# Altium project FMC_DAC_125M_14B_16CHA.PrjPCB (part 4 of 4)
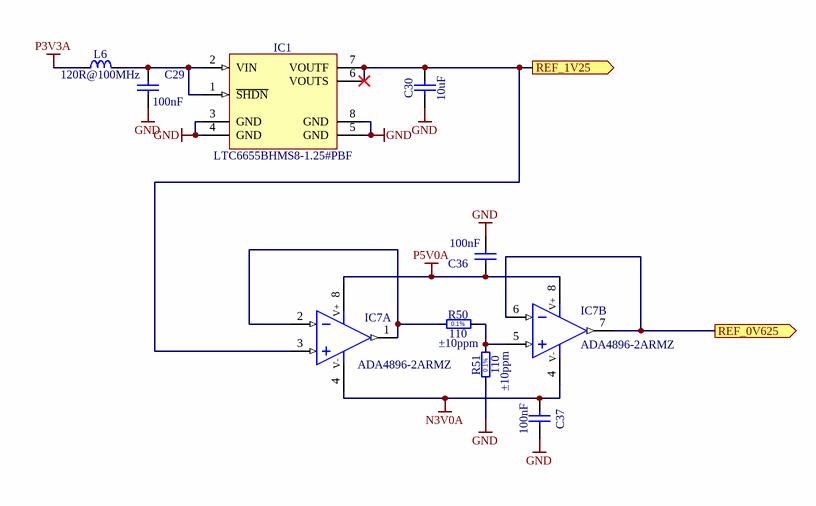
[diagram p10: References.SchDoc]

## Nets that join several sheets
3P3VAUX: EEPROM_Temp (12 pins), FMC connector (J1.d32)
GND: FMC_DAC_125M_14B_16CHA (7 pins), EEPROM_Temp (14 pins), FMC connector (164 pins), power_supply (16 pins), U_SAS_Connectors0 (18 pins), U_DAC_AFE0 (9 pins), U_DAC_AFE1 (9 pins), U_DAC_AFE2 (9 pins), U_DAC_AFE3 (9 pins), U_DAC_AFE4 (9 pins), U_DAC_AFE5 (9 pins), U_DAC_AFE6 (9 pins), U_DAC_AFE7 (9 pins), U_DAC_AFE8 (9 pins), U_DAC_AFE9 (9 pins), U_DAC_AFE10 (9 pins), U_DAC_AFE11 (9 pins), U_DAC_AFE12 (9 pins), U_DAC_AFE13 (9 pins), U_DAC_AFE14 (9 pins), U_DAC_AFE15 (9 pins), U_SAS_Connectors1 (18 pins), U_DACs0 (12 pins), U_DACs1 (12 pins), U_DACs2 (12 pins), U_DACs3 (12 pins), U_DACs4 (12 pins), U_DACs5 (12 pins), U_DACs6 (12 pins), U_DACs7 (12 pins), Clock_circuit (27 pins), AFE_buffers0 (8 pins), AFE_buffers1 (8 pins), References (9 pins)
N3V0A: power_supply (J8.7 J8.8), U_DAC_AFE0 (L2A.1), U_DAC_AFE1 (L2B.1), U_DAC_AFE2 (L2C.1), U_DAC_AFE3 (L2D.1), U_DAC_AFE4 (L2E.1), U_DAC_AFE5 (L2F.1), U_DAC_AFE6 (L2G.1), U_DAC_AFE7 (L2H.1), U_DAC_AFE8 (L2I.1), U_DAC_AFE9 (L2J.1), U_DAC_AFE10 (L2K.1), U_DAC_AFE11 (L2L.1), U_DAC_AFE12 (L2M.1), U_DAC_AFE13 (L2N.1), U_DAC_AFE14 (L2O.1), U_DAC_AFE15 (L2P.1), References (C37.2 IC7.4)
P1V8A: power_supply (J8.17 J8.18), U_DACs0 (C8A.1 IC8A.17), U_DACs1 (C8B.1 IC8B.17), U_DACs2 (C8C.1 IC8C.17), U_DACs3 (C8D.1 IC8D.17), U_DACs4 (C8E.1 IC8E.17), U_DACs5 (C8F.1 IC8F.17), U_DACs6 (C8G.1 IC8G.17), U_DACs7 (C8H.1 IC8H.17), Clock_circuit (5 pins)
P3V3: FMC_DAC_125M_14B_16CHA (LD1.2 LD1.4 LD2.2 LD2.4), FMC connector (5 pins), power_supply (J8.21 J8.22 R138.1)
P3V3A: power_supply (C275.1 J8.29 J8.30), U_DACs0 (C9A.1 IC8A.26), U_DACs1 (C9B.1 IC8B.26), U_DACs2 (C9C.1 IC8C.26), U_DACs3 (C9D.1 IC8D.26), U_DACs4 (C9E.1 IC8E.26), U_DACs5 (C9F.1 IC8F.26), U_DACs6 (C9G.1 IC8G.26), U_DACs7 (C9H.1 IC8H.26), AFE_buffers0 (12 pins), AFE_buffers1 (12 pins), References (L6.2)
P5V0A: power_supply (J8.13 J8.14), U_DAC_AFE0 (L1A.2), U_DAC_AFE1 (L1B.2), U_DAC_AFE2 (L1C.2), U_DAC_AFE3 (L1D.2), U_DAC_AFE4 (L1E.2), U_DAC_AFE5 (L1F.2), U_DAC_AFE6 (L1G.2), U_DAC_AFE7 (L1H.2), U_DAC_AFE8 (L1I.2), U_DAC_AFE9 (L1J.2), U_DAC_AFE10 (L1K.2), U_DAC_AFE11 (L1L.2), U_DAC_AFE12 (L1M.2), U_DAC_AFE13 (L1N.2), U_DAC_AFE14 (L1O.2), U_DAC_AFE15 (L1P.2), References (C36.2 IC7.8)
P12V0: FMC connector (J1.c35 J1.c37), power_supply (J8.3 J8.4)
VADJ: FMC_DAC_125M_14B_16CHA (C31.2 IC4.6 IC4.16), FMC connector (5 pins), power_supply (L7.1), AFE_buffers0 (C32A.2 C34A.2 IC5A.3 IC6A.3), AFE_buffers1 (C32B.2 C34B.2 IC5B.3 IC6B.3)
VADJ_BUF: power_supply (C42.1 L7.2), U_DACs0 (C7A.1 C10A.2 IC8A.5 R68A.1), U_DACs1 (C7B.1 C10B.2 IC8B.5 R68B.1), U_DACs2 (C7C.1 C10C.2 IC8C.5 R68C.1), U_DACs3 (C7D.1 C10D.2 IC8D.5 R68D.1), U_DACs4 (C7E.1 C10E.2 IC8E.5 R68E.1), U_DACs5 (C7F.1 C10F.2 IC8F.5 R68F.1), U_DACs6 (C7G.1 C10G.2 IC8G.5 R68G.1), U_DACs7 (C7H.1 C10H.2 IC8H.5 R68H.1), Clock_circuit (L4.1 R71.1)
AFE0_CTRL_0: U_SAS_Connectors0 (J2A.A8), AFE_buffers0 (R40A.1 R48A.1)
AFE0_CTRL_1: U_SAS_Connectors0 (J2A.B8), AFE_buffers0 (R41A.1 R49A.1)
AFE0_CTRL_2: U_SAS_Connectors0 (J2A.A9), AFE_buffers0 (R42A.1 R60A.1)
AFE0_CTRL_3: U_SAS_Connectors0 (J2A.B9), AFE_buffers0 (R43A.1 R61A.1)
AFE0_CTRL_4: U_SAS_Connectors0 (J2A.A10), AFE_buffers0 (R44A.1 R62A.1)
AFE0_CTRL_5: U_SAS_Connectors0 (J2A.B10), AFE_buffers0 (R45A.1 R63A.1)
AFE0_CTRL_6: U_SAS_Connectors0 (J2A.A11), AFE_buffers0 (R46A.1 R64A.1)
AFE0_CTRL_7: U_SAS_Connectors0 (J2A.B11), AFE_buffers0 (R47A.1 R65A.1)
AFE0_CTRL_VADJ_0: FMC connector (J1.h7), AFE_buffers0 (IC5A.6)
AFE0_CTRL_VADJ_1: FMC connector (J1.h8), AFE_buffers0 (IC5A.7)
AFE0_CTRL_VADJ_2: FMC connector (J1.g7), AFE_buffers0 (IC5A.8)
AFE0_CTRL_VADJ_3: FMC connector (J1.d9), AFE_buffers0 (IC5A.9)
AFE0_CTRL_VADJ_4: FMC connector (J1.d21), AFE_buffers0 (IC6A.6)
AFE0_CTRL_VADJ_5: FMC connector (J1.c26), AFE_buffers0 (IC6A.7)
AFE0_CTRL_VADJ_6: FMC connector (J1.c27), AFE_buffers0 (IC6A.8)
AFE0_CTRL_VADJ_7: FMC connector (J1.d26), AFE_buffers0 (IC6A.9)
AFE1_CTRL_0: U_SAS_Connectors1 (J2B.A8), AFE_buffers1 (R40B.1 R48B.1)
AFE1_CTRL_1: U_SAS_Connectors1 (J2B.B8), AFE_buffers1 (R41B.1 R49B.1)
AFE1_CTRL_2: U_SAS_Connectors1 (J2B.A9), AFE_buffers1 (R42B.1 R60B.1)
AFE1_CTRL_3: U_SAS_Connectors1 (J2B.B9), AFE_buffers1 (R43B.1 R61B.1)
AFE1_CTRL_4: U_SAS_Connectors1 (J2B.A10), AFE_buffers1 (R44B.1 R62B.1)
AFE1_CTRL_5: U_SAS_Connectors1 (J2B.B10), AFE_buffers1 (R45B.1 R63B.1)
AFE1_CTRL_6: U_SAS_Connectors1 (J2B.A11), AFE_buffers1 (R46B.1 R64B.1)
AFE1_CTRL_7: U_SAS_Connectors1 (J2B.B11), AFE_buffers1 (R47B.1 R65B.1)
AFE1_CTRL_VADJ_0: FMC connector (J1.g30), AFE_buffers1 (IC5B.6)
AFE1_CTRL_VADJ_1: FMC connector (J1.g31), AFE_buffers1 (IC5B.7)
AFE1_CTRL_VADJ_2: FMC connector (J1.h31), AFE_buffers1 (IC5B.8)
AFE1_CTRL_VADJ_3: FMC connector (J1.h32), AFE_buffers1 (IC5B.9)
AFE1_CTRL_VADJ_4: FMC connector (J1.h35), AFE_buffers1 (IC6B.6)
AFE1_CTRL_VADJ_5: FMC connector (J1.g36), AFE_buffers1 (IC6B.7)
AFE1_CTRL_VADJ_6: FMC connector (J1.e36), AFE_buffers1 (IC6B.8)
AFE1_CTRL_VADJ_7: FMC connector (J1.j36), AFE_buffers1 (IC6B.9)
AFE_REF: U_DAC_AFE0 (C11A.1 R66A.1 R67A.1), U_DAC_AFE1 (C11B.1 R66B.1 R67B.1), U_DAC_AFE2 (C11C.1 R66C.1 R67C.1), U_DAC_AFE3 (C11D.1 R66D.1 R67D.1), U_DAC_AFE4 (C11E.1 R66E.1 R67E.1), U_DAC_AFE5 (C11F.1 R66F.1 R67F.1), U_DAC_AFE6 (C11G.1 R66G.1 R67G.1), U_DAC_AFE7 (C11H.1 R66H.1 R67H.1), U_DAC_AFE8 (C11I.1 R66I.1 R67I.1), U_DAC_AFE9 (C11J.1 R66J.1 R67J.1), U_DAC_AFE10 (C11K.1 R66K.1 R67K.1), U_DAC_AFE11 (C11L.1 R66L.1 R67L.1), U_DAC_AFE12 (C11M.1 R66M.1 R67M.1), U_DAC_AFE13 (C11N.1 R66N.1 R67N.1), U_DAC_AFE14 (C11O.1 R66O.1 R67O.1), U_DAC_AFE15 (C11P.1 R66P.1 R67P.1), References (IC7.6 IC7.7)
AOUT0_N: U_SAS_Connectors0 (J2A.A3), U_DAC_AFE0 (R36A.2)
AOUT0_N: U_DAC_AFE8 (R36I.2), U_SAS_Connectors1 (J2B.A3)
AOUT0_P: U_SAS_Connectors0 (J2A.A2), U_DAC_AFE0 (R39A.2)
AOUT0_P: U_DAC_AFE8 (R39I.2), U_SAS_Connectors1 (J2B.A2)
AOUT1_N: U_SAS_Connectors0 (J2A.B3), U_DAC_AFE1 (R36B.2)
AOUT1_N: U_DAC_AFE9 (R36J.2), U_SAS_Connectors1 (J2B.B3)
AOUT1_P: U_SAS_Connectors0 (J2A.B2), U_DAC_AFE1 (R39B.2)
AOUT1_P: U_DAC_AFE9 (R39J.2), U_SAS_Connectors1 (J2B.B2)
AOUT2_N: U_SAS_Connectors0 (J2A.A6), U_DAC_AFE2 (R36C.2)
AOUT2_N: U_DAC_AFE10 (R36K.2), U_SAS_Connectors1 (J2B.A6)
AOUT2_P: U_SAS_Connectors0 (J2A.A5), U_DAC_AFE2 (R39C.2)
AOUT2_P: U_DAC_AFE10 (R39K.2), U_SAS_Connectors1 (J2B.A5)
AOUT3_N: U_SAS_Connectors0 (J2A.B6), U_DAC_AFE3 (R36D.2)
AOUT3_N: U_DAC_AFE11 (R36L.2), U_SAS_Connectors1 (J2B.B6)
AOUT3_P: U_SAS_Connectors0 (J2A.B5), U_DAC_AFE3 (R39D.2)
AOUT3_P: U_DAC_AFE11 (R39L.2), U_SAS_Connectors1 (J2B.B5)
AOUT4_N: U_SAS_Connectors0 (J2A.A14), U_DAC_AFE4 (R36E.2)
AOUT4_N: U_DAC_AFE12 (R36M.2), U_SAS_Connectors1 (J2B.A14)
AOUT4_P: U_SAS_Connectors0 (J2A.A13), U_DAC_AFE4 (R39E.2)
AOUT4_P: U_DAC_AFE12 (R39M.2), U_SAS_Connectors1 (J2B.A13)
AOUT5_N: U_SAS_Connectors0 (J2A.B14), U_DAC_AFE5 (R36F.2)
AOUT5_N: U_DAC_AFE13 (R36N.2), U_SAS_Connectors1 (J2B.B14)
AOUT5_P: U_SAS_Connectors0 (J2A.B13), U_DAC_AFE5 (R39F.2)
AOUT5_P: U_DAC_AFE13 (R39N.2), U_SAS_Connectors1 (J2B.B13)
AOUT6_N: U_SAS_Connectors0 (J2A.A17), U_DAC_AFE6 (R36G.2)
AOUT6_N: U_DAC_AFE14 (R36O.2), U_SAS_Connectors1 (J2B.A17)
AOUT6_P: U_SAS_Connectors0 (J2A.A16), U_DAC_AFE6 (R39G.2)
AOUT6_P: U_DAC_AFE14 (R39O.2), U_SAS_Connectors1 (J2B.A16)
AOUT7_N: U_SAS_Connectors0 (J2A.B17), U_DAC_AFE7 (R36H.2)
AOUT7_N: U_DAC_AFE15 (R36P.2), U_SAS_Connectors1 (J2B.B17)
AOUT7_P: U_SAS_Connectors0 (J2A.B16), U_DAC_AFE7 (R39H.2)
AOUT7_P: U_DAC_AFE15 (R39P.2), U_SAS_Connectors1 (J2B.B16)
CLK0_M2C_N: FMC connector (J1.h5), Clock_circuit (U2.45)
CLK0_M2C_P: FMC connector (J1.h4), Clock_circuit (U2.46)
CLK1_M2C_N: FMC connector (J1.g3), Clock_circuit (U2.47)
CLK1_M2C_P: FMC connector (J1.g2), Clock_circuit (U2.48)
CS_A0: FMC_DAC_125M_14B_16CHA (IC4.1 TP4.1), FMC connector (J1.g33)
CS_A1: FMC_DAC_125M_14B_16CHA (IC4.2 TP5.1), FMC connector (J1.e33)
CS_A2: FMC_DAC_125M_14B_16CHA (IC4.3 TP7.1), FMC connector (J1.h34)
CSn: FMC_DAC_125M_14B_16CHA (IC4.4 TP8.1), FMC connector (J1.g34)
CSn0: FMC_DAC_125M_14B_16CHA (IC4.7), U_DACs7 (IC8H.38)
CSn0: FMC_DAC_125M_14B_16CHA (IC4.9), U_DACs6 (IC8G.38)
CSn0: FMC_DAC_125M_14B_16CHA (IC4.10), U_DACs5 (IC8F.38)
CSn0: FMC_DAC_125M_14B_16CHA (IC4.11), U_DACs4 (IC8E.38)
CSn0: FMC_DAC_125M_14B_16CHA (IC4.12), U_DACs3 (IC8D.38)
CSn0: FMC_DAC_125M_14B_16CHA (IC4.13), U_DACs2 (IC8C.38)
CSn0: FMC_DAC_125M_14B_16CHA (IC4.14), U_DACs1 (IC8B.38)
CSn0: FMC_DAC_125M_14B_16CHA (IC4.15 TP6.1), U_DACs0 (IC8A.38)
DAC_CLK0: U_DACs0 (IC8A.18), Clock_circuit (R32.2)
DAC_CLK1: U_DACs1 (IC8B.18), Clock_circuit (R31.2)
DAC_CLK2: U_DACs2 (IC8C.18), Clock_circuit (R29.2)
DAC_CLK3: U_DACs3 (IC8D.18), Clock_circuit (R27.2)
DAC_CLK4: U_DACs4 (IC8E.18), Clock_circuit (R26.2)
DAC_CLK5: U_DACs5 (IC8F.18), Clock_circuit (R23.2)
DAC_CLK6: U_DACs6 (IC8G.18), Clock_circuit (R20.2)
DAC_CLK7: U_DACs7 (IC8H.18), Clock_circuit (R18.2)
DAC_IOUT_N: U_DAC_AFE0 (R2A.1), U_DACs0 (IC8A.29)
DAC_IOUT_N: U_DAC_AFE2 (R2C.1), U_DACs1 (IC8B.29)
DAC_IOUT_N: U_DAC_AFE4 (R2E.1), U_DACs2 (IC8C.29)
DAC_IOUT_N: U_DAC_AFE6 (R2G.1), U_DACs3 (IC8D.29)
DAC_IOUT_N: U_DAC_AFE8 (R2I.1), U_DACs4 (IC8E.29)
DAC_IOUT_N: U_DAC_AFE10 (R2K.1), U_DACs5 (IC8F.29)
DAC_IOUT_N: U_DAC_AFE12 (R2M.1), U_DACs6 (IC8G.29)
DAC_IOUT_N: U_DAC_AFE14 (R2O.1), U_DACs7 (IC8H.29)
DAC_IOUT_P: U_DAC_AFE0 (R1A.1), U_DACs0 (IC8A.28)
DAC_IOUT_P: U_DAC_AFE2 (R1C.1), U_DACs1 (IC8B.28)
DAC_IOUT_P: U_DAC_AFE4 (R1E.1), U_DACs2 (IC8C.28)
DAC_IOUT_P: U_DAC_AFE6 (R1G.1), U_DACs3 (IC8D.28)
DAC_IOUT_P: U_DAC_AFE8 (R1I.1), U_DACs4 (IC8E.28)
DAC_IOUT_P: U_DAC_AFE10 (R1K.1), U_DACs5 (IC8F.28)
DAC_IOUT_P: U_DAC_AFE12 (R1M.1), U_DACs6 (IC8G.28)
DAC_IOUT_P: U_DAC_AFE14 (R1O.1), U_DACs7 (IC8H.28)
DAC_QOUT_N: U_DAC_AFE1 (R2B.1), U_DACs0 (IC8A.22)
DAC_QOUT_N: U_DAC_AFE3 (R2D.1), U_DACs1 (IC8B.22)
DAC_QOUT_N: U_DAC_AFE5 (R2F.1), U_DACs2 (IC8C.22)
DAC_QOUT_N: U_DAC_AFE7 (R2H.1), U_DACs3 (IC8D.22)
DAC_QOUT_N: U_DAC_AFE9 (R2J.1), U_DACs4 (IC8E.22)
DAC_QOUT_N: U_DAC_AFE11 (R2L.1), U_DACs5 (IC8F.22)
DAC_QOUT_N: U_DAC_AFE13 (R2N.1), U_DACs6 (IC8G.22)
DAC_QOUT_N: U_DAC_AFE15 (R2P.1), U_DACs7 (IC8H.22)
DAC_QOUT_P: U_DAC_AFE1 (R1B.1), U_DACs0 (IC8A.23)
DAC_QOUT_P: U_DAC_AFE3 (R1D.1), U_DACs1 (IC8B.23)
DAC_QOUT_P: U_DAC_AFE5 (R1F.1), U_DACs2 (IC8C.23)
DAC_QOUT_P: U_DAC_AFE7 (R1H.1), U_DACs3 (IC8D.23)
DAC_QOUT_P: U_DAC_AFE9 (R1J.1), U_DACs4 (IC8E.23)
DAC_QOUT_P: U_DAC_AFE11 (R1L.1), U_DACs5 (IC8F.23)
DAC_QOUT_P: U_DAC_AFE13 (R1N.1), U_DACs6 (IC8G.23)
DAC_QOUT_P: U_DAC_AFE15 (R1P.1), U_DACs7 (IC8H.23)
DAC_REF: U_DACs0 (C12A.1 IC8A.34), U_DACs1 (C12B.1 IC8B.34), U_DACs2 (C12C.1 IC8C.34), U_DACs3 (C12D.1 IC8D.34), U_DACs4 (C12E.1 IC8E.34), U_DACs5 (C12F.1 IC8F.34), U_DACs6 (C12G.1 IC8G.34), U_DACs7 (C12H.1 IC8H.34), References (C30.2 IC1.6 IC1.7 IC7.3)
DATA0: FMC connector (J1.c19), U_DACs3 (IC8D.15)
DATA0: FMC connector (J1.d14), U_DACs1 (IC8B.15)
DATA0: FMC connector (J1.e31), U_DACs7 (IC8H.15)
DATA0: FMC connector (J1.f29), U_DACs6 (IC8G.15)
DATA0: FMC connector (J1.j16), U_DACs2 (IC8C.15)
DATA0: FMC connector (J1.j22), U_DACs4 (IC8E.15)
DATA0: FMC connector (J1.h29), U_DACs5 (IC8F.15)
DATA0: FMC connector (J1.k11), U_DACs0 (IC8A.15)
DATA1: FMC connector (J1.d15), U_DACs1 (IC8B.14)
DATA1: FMC connector (J1.f20), U_DACs4 (IC8E.14)
DATA1: FMC connector (J1.f28), U_DACs6 (IC8G.14)
DATA1: FMC connector (J1.f32), U_DACs7 (IC8H.14)
DATA1: FMC connector (J1.j15), U_DACs2 (IC8C.14)
DATA1: FMC connector (J1.g28), U_DACs5 (IC8F.14)
DATA1: FMC connector (J1.h20), U_DACs3 (IC8D.14)
DATA1: FMC connector (J1.k10), U_DACs0 (IC8A.14)
DATA2: FMC connector (J1.e30), U_DACs7 (IC8H.13)
DATA2: FMC connector (J1.f14), U_DACs2 (IC8C.13)
DATA2: FMC connector (J1.j10), U_DACs0 (IC8A.13)
DATA2: FMC connector (J1.j21), U_DACs4 (IC8E.13)
DATA2: FMC connector (J1.j28), U_DACs6 (IC8G.13)
DATA2: FMC connector (J1.g19), U_DACs3 (IC8D.13)
DATA2: FMC connector (J1.h14), U_DACs1 (IC8B.13)
DATA2: FMC connector (J1.h28), U_DACs5 (IC8F.13)
DATA3: FMC connector (J1.f13), U_DACs2 (IC8C.12)
DATA3: FMC connector (J1.f31), U_DACs7 (IC8H.12)
DATA3: FMC connector (J1.j27), U_DACs6 (IC8G.12)
DATA3: FMC connector (J1.g13), U_DACs1 (IC8B.12)
DATA3: FMC connector (J1.g27), U_DACs5 (IC8F.12)
DATA3: FMC connector (J1.h19), U_DACs3 (IC8D.12)
DATA3: FMC connector (J1.k8), U_DACs0 (IC8A.12)
DATA3: FMC connector (J1.k20), U_DACs4 (IC8E.12)
DATA4: FMC connector (J1.c18), U_DACs3 (IC8D.11)
DATA4: FMC connector (J1.e13), U_DACs2 (IC8C.11)
DATA4: FMC connector (J1.f26), U_DACs6 (IC8G.11)
DATA4: FMC connector (J1.j9), U_DACs0 (IC8A.11)
DATA4: FMC connector (J1.j34), U_DACs7 (IC8H.11)
DATA4: FMC connector (J1.h13), U_DACs1 (IC8B.11)
DATA4: FMC connector (J1.h26), U_DACs5 (IC8F.11)
DATA4: FMC connector (J1.k19), U_DACs4 (IC8E.11)
DATA5: FMC connector (J1.d18), U_DACs3 (IC8D.10)
DATA5: FMC connector (J1.f19), U_DACs4 (IC8E.10)
DATA5: FMC connector (J1.f25), U_DACs6 (IC8G.10)
DATA5: FMC connector (J1.j33), U_DACs7 (IC8H.10)
DATA5: FMC connector (J1.g12), U_DACs1 (IC8B.10)
DATA5: FMC connector (J1.h25), U_DACs5 (IC8F.10)
DATA5: FMC connector (J1.k7), U_DACs0 (IC8A.10)
DATA5: FMC connector (J1.k14), U_DACs2 (IC8C.10)
DATA6: FMC connector (J1.d12), U_DACs1 (IC8B.9)
DATA6: FMC connector (J1.j7), U_DACs0 (IC8A.9)
DATA6: FMC connector (J1.j19), U_DACs4 (IC8E.9)
DATA6: FMC connector (J1.j25), U_DACs6 (IC8G.9)
DATA6: FMC connector (J1.j31), U_DACs7 (IC8H.9)
DATA6: FMC connector (J1.g18), U_DACs3 (IC8D.9)
DATA6: FMC connector (J1.g25), U_DACs5 (IC8F.9)
DATA6: FMC connector (J1.k13), U_DACs2 (IC8C.9)
DATA7: FMC connector (J1.d17), U_DACs3 (IC8D.8)
DATA7: FMC connector (J1.e19), U_DACs4 (IC8E.8)
DATA7: FMC connector (J1.e25), U_DACs6 (IC8G.8)
DATA7: FMC connector (J1.e28), U_DACs7 (IC8H.8)
DATA7: FMC connector (J1.j6), U_DACs0 (IC8A.8)
DATA7: FMC connector (J1.j13), U_DACs2 (IC8C.8)
DATA7: FMC connector (J1.g24), U_DACs5 (IC8F.8)
DATA7: FMC connector (J1.h11), U_DACs1 (IC8B.8)
DATA8: FMC connector (J1.d11), U_DACs1 (IC8B.4)
DATA8: FMC connector (J1.d24), U_DACs5 (IC8F.4)
DATA8: FMC connector (J1.e18), U_DACs4 (IC8E.4)
DATA8: FMC connector (J1.e27), U_DACs7 (IC8H.4)
DATA8: FMC connector (J1.f8), U_DACs0 (IC8A.4)
DATA8: FMC connector (J1.j12), U_DACs2 (IC8C.4)
DATA8: FMC connector (J1.j24), U_DACs6 (IC8G.4)
DATA8: FMC connector (J1.h17), U_DACs3 (IC8D.4)
DATA9: FMC connector (J1.c11), U_DACs1 (IC8B.3)
DATA9: FMC connector (J1.d23), U_DACs5 (IC8F.3)
DATA9: FMC connector (J1.e12), U_DACs2 (IC8C.3)
DATA9: FMC connector (J1.e24), U_DACs6 (IC8G.3)
DATA9: FMC connector (J1.f7), U_DACs0 (IC8A.3)
DATA9: FMC connector (J1.j18), U_DACs4 (IC8E.3)
DATA9: FMC connector (J1.g16), U_DACs3 (IC8D.3)
DATA9: FMC connector (J1.k35), U_DACs7 (IC8H.3)
DATA10: FMC connector (J1.e7), U_DACs0 (IC8A.2)
DATA10: FMC connector (J1.f11), U_DACs2 (IC8C.2)
DATA10: FMC connector (J1.f17), U_DACs4 (IC8E.2)
DATA10: FMC connector (J1.f23), U_DACs6 (IC8G.2)
DATA10: FMC connector (J1.h10), U_DACs1 (IC8B.2)
DATA10: FMC connector (J1.h16), U_DACs3 (IC8D.2)
DATA10: FMC connector (J1.h23), U_DACs5 (IC8F.2)
DATA10: FMC connector (J1.k34), U_DACs7 (IC8H.2)
DATA11: FMC connector (J1.e6), U_DACs0 (IC8A.1)
DATA11: FMC connector (J1.f10), U_DACs2 (IC8C.1)
DATA11: FMC connector (J1.f16), U_DACs4 (IC8E.1)
DATA11: FMC connector (J1.f22), U_DACs6 (IC8G.1)
DATA11: FMC connector (J1.g10), U_DACs1 (IC8B.1)
DATA11: FMC connector (J1.g15), U_DACs3 (IC8D.1)
DATA11: FMC connector (J1.h22), U_DACs5 (IC8F.1)
DATA11: FMC connector (J1.k32), U_DACs7 (IC8H.1)
DATA12: FMC connector (J1.c15), U_DACs3 (IC8D.40)
DATA12: FMC connector (J1.e10), U_DACs2 (IC8C.40)
DATA12: FMC connector (J1.e16), U_DACs4 (IC8E.40)
DATA12: FMC connector (J1.e22), U_DACs6 (IC8G.40)
DATA12: FMC connector (J1.f5), U_DACs0 (IC8A.40)
DATA12: FMC connector (J1.g9), U_DACs1 (IC8B.40)
DATA12: FMC connector (J1.g22), U_DACs5 (IC8F.40)
DATA12: FMC connector (J1.k31), U_DACs7 (IC8H.40)
DATA13: FMC connector (J1.c10), U_DACs1 (IC8B.39)
DATA13: FMC connector (J1.c14), U_DACs3 (IC8D.39)
DATA13: FMC connector (J1.e3), U_DACs0 (IC8A.39)
DATA13: FMC connector (J1.e9), U_DACs2 (IC8C.39)
DATA13: FMC connector (J1.e15), U_DACs4 (IC8E.39)
DATA13: FMC connector (J1.e21), U_DACs6 (IC8G.39)
DATA13: FMC connector (J1.j30), U_DACs7 (IC8H.39)
DATA13: FMC connector (J1.g21), U_DACs5 (IC8F.39)
DCLKIO: FMC connector (J1.d8), U_DACs3 (R11D.1)
DCLKIO: FMC connector (J1.d20), U_DACs5 (R11F.1)
DCLKIO: FMC connector (J1.e2), U_DACs2 (R11C.1)
DCLKIO: FMC connector (J1.f4), U_DACs0 (R11A.1)
DCLKIO: FMC connector (J1.g6), U_DACs1 (R11B.1)
DCLKIO: FMC connector (J1.k16), U_DACs4 (R11E.1)
DCLKIO: FMC connector (J1.k25), U_DACs6 (R11G.1)
DCLKIO: FMC connector (J1.k28), U_DACs7 (R11H.1)
FPGA_CLK2_N: FMC connector (J1.c23), Clock_circuit (U2.41)
FPGA_CLK2_P: FMC connector (J1.c22), Clock_circuit (U2.42)
GA0: EEPROM_Temp (IC40.2), FMC connector (J1.c34)
GA1: EEPROM_Temp (IC40.1), FMC connector (J1.d35)
HA17_CC_N: FMC connector (J1.k17), AFE_buffers0 (IC6A.5), AFE_buffers1 (IC6B.5)
HA23_N: FMC_DAC_125M_14B_16CHA (T1.2), FMC connector (J1.k23)
HA23_P: FMC_DAC_125M_14B_16CHA (T1.5), FMC connector (J1.k22)
HB00_CC_N: FMC connector (J1.k26), AFE_buffers0 (IC5A.5), AFE_buffers1 (IC5B.5)
HB06_CC_N: FMC_DAC_125M_14B_16CHA (TP10.1), FMC connector (J1.k29), U_DACs0 (IC8A.37), U_DACs1 (IC8B.37), U_DACs2 (IC8C.37), U_DACs3 (IC8D.37), U_DACs4 (IC8E.37), U_DACs5 (IC8F.37), U_DACs6 (IC8G.37), U_DACs7 (IC8H.37)
HB16_N: FMC_DAC_125M_14B_16CHA (TP9.1), FMC connector (J1.f35), U_DACs0 (IC8A.36), U_DACs1 (IC8B.36), U_DACs2 (IC8C.36), U_DACs3 (IC8D.36), U_DACs4 (IC8E.36), U_DACs5 (IC8F.36), U_DACs6 (IC8G.36), U_DACs7 (IC8H.36)
HB16_P: FMC_DAC_125M_14B_16CHA (TP11.1), FMC connector (J1.f34), U_DACs0 (IC8A.35), U_DACs1 (IC8B.35), U_DACs2 (IC8C.35), U_DACs3 (IC8D.35), U_DACs4 (IC8E.35), U_DACs5 (IC8F.35), U_DACs6 (IC8G.35), U_DACs7 (IC8H.35)
HB17_CC_N: FMC connector (J1.k38), Clock_circuit (R28.1 R30.2)
HB17_CC_P: FMC connector (J1.k37), AFE_buffers0 (IC6A.4), AFE_buffers1 (IC6B.4)
HB18_N: FMC_DAC_125M_14B_16CHA (T2.5), FMC connector (J1.j37)
HB19_N: FMC connector (J1.e34), AFE_buffers0 (IC5A.1 IC5A.16 IC6A.1 IC6A.16), AFE_buffers1 (IC5B.1 IC5B.16 IC6B.1 IC6B.16)
HB20_N: FMC connector (J1.f38), Clock_circuit (R8.1 R10.2 R16.2)
HB20_P: FMC connector (J1.f37), Clock_circuit (OSC1.7 R5.1 TP1.1)
HB21_N: FMC connector (J1.e37), Clock_circuit (OSC1.8 R6.1 TP2.1)
LA26_N: FMC connector (J1.d27), AFE_buffers0 (IC5A.4), AFE_buffers1 (IC5B.4)
LA32_N: FMC connector (J1.h38), Clock_circuit (R17.1 R24.2)
LA32_P: FMC_DAC_125M_14B_16CHA (T2.2), FMC connector (J1.h37)
PG_M2C: FMC connector (J1.f1), power_supply (J8.11 R138.2)
REFA_N: FMC connector (R56.1 R57.1), Clock_circuit (C18.1 R14.1)
REFA_P: FMC connector (R54.1 R55.1), Clock_circuit (C17.1 R14.2)
SCL: EEPROM_Temp (B15.1 IC40.6 R114.2 R116.1), FMC connector (J1.c30)
SDA: EEPROM_Temp (B14.1 IC40.5 R113.2 R115.1), FMC connector (J1.c31)
TEMP_ALARM: EEPROM_Temp (IC38.3 IC39.3 R105.1), power_supply (J8.9)

## Assembly variants
default: not fitted R12 R12 R13 R55 R56 R68A R68B R68C R68D R68E R68F R68G R68H R70 R71